# Altium project Board2.PrjPcb
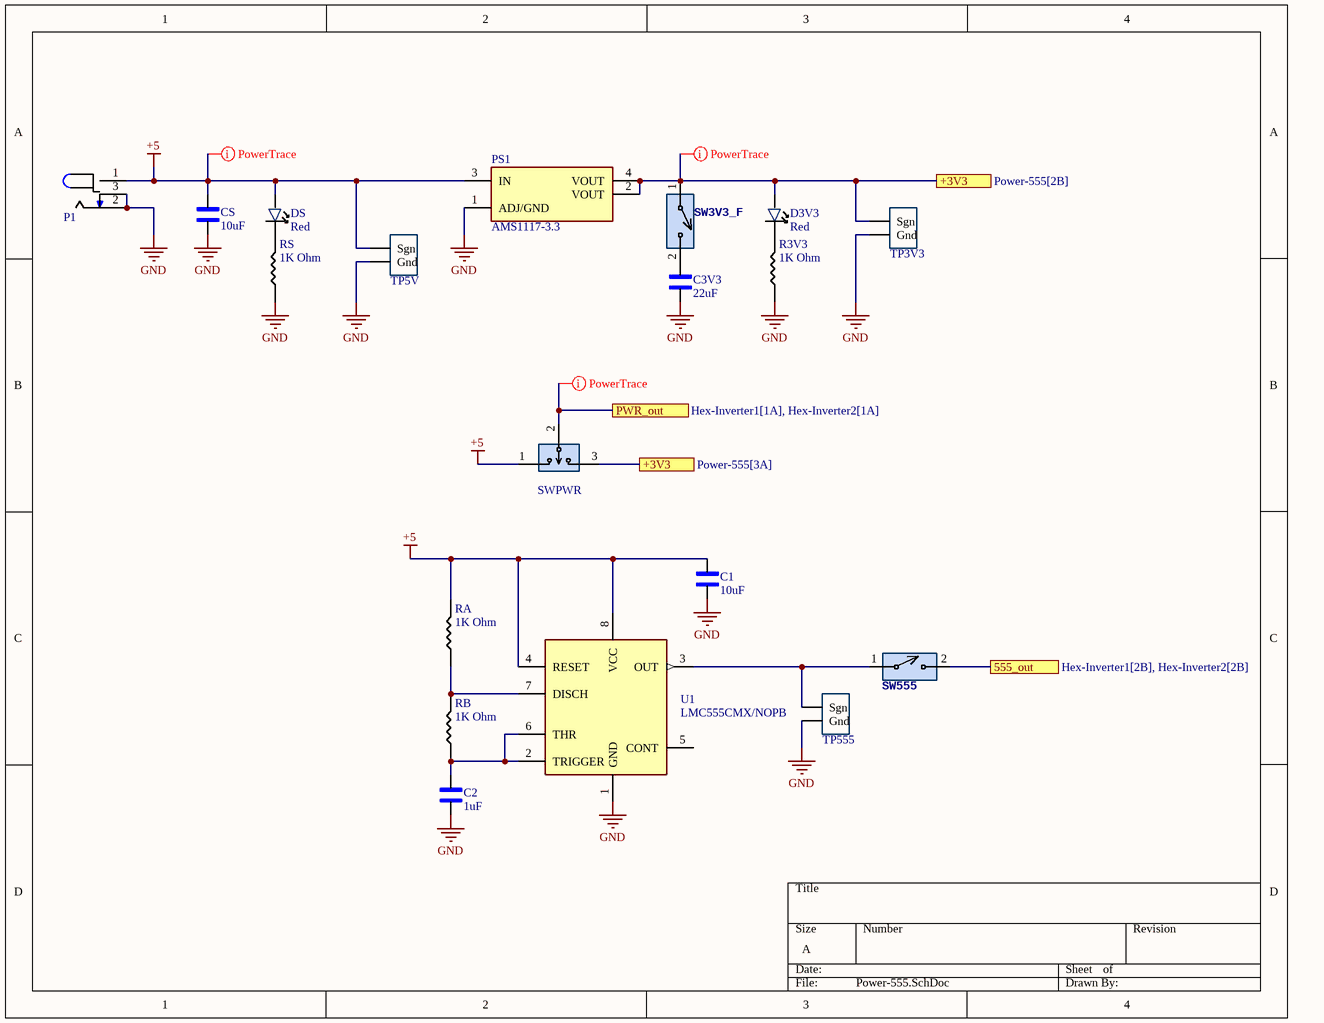
[diagram p0: Power-555.SchDoc]
3 sheets, 47 parts. Net scope: flat (ports and power ports of the same name join across sheets).
Board file: PCB1.PcbDoc
Sheets:
  Power-555.SchDoc
  Hex-Inverter1.SchDoc
  Hex-Inverter2.SchDoc

## Sheet Power-555.SchDoc
size A; SheetNumber: 1; SheetTotal: 3

### Parts
C1  10uF  [1206_Passive_Capacitor]
C2  1uF  [1206_Passive_Capacitor]
C3V3  22uF  [1206_Passive_Capacitor]
CS  10uF  [1206_Passive_Capacitor]
D3V3  Red  [LED_1206]
DS  Red  [LED_1206]
P1  Power Jack  [Power_Jack]  (value not drawn)
PS1  AMS1117-3.3  [LDO]
R3V3  value 1K Ohm  [1206_Passive_Resitor]  (hidden comment: 1k)
RA  value 1K Ohm  [1206_Passive_Resitor]  (hidden comment: 1k)
RB  value 1K Ohm  [1206_Passive_Resitor]  (hidden comment: 1k)
RS  value 1K Ohm  [1206_Passive_Resitor]  (hidden comment: 1k)
SW3V3_F  SW_2Pin_100mil_Switch  [2Pin-Header-Conn]  (value not drawn)
SW555  SW_2Pin_100mil_Switch  [2Pin-Header-Conn]  (value not drawn)
SWPWR  PREC003SAAN-RC  [3_PIN_100mil]  (value not drawn)
TP3V3  10x Probe TP  [TP10x_Probe]  (value not drawn)
TP5V  10x Probe TP  [TP10x_Probe]  (value not drawn)
TP555  10x Probe TP  [TP10x_Probe]  (value not drawn)
U1  LMC555CMX/NOPB  [TS555IDTTR]

### Ports
555_out (see Hex-Inverter1[2B], Hex-Inverter2[2B]), +3V3 (see Power-555[2B]), +3V3 (see Power-555[3A]), PWR_out (see Hex-Inverter1[1A], Hex-Inverter2[1A])

### Nets
+5: C1.2 CS.2 DS.1 P1.1 PS1.3(IN) RA.2 SWPWR.1 TP5V.1(Sgn) U1.4(RESET) U1.8(VCC)
GND: C1.1 C2.1 C3V3.1 CS.1 P1.2 P1.3 PS1.1(ADJ/GND) R3V3.1 RS.1 TP3V3.2(Gnd) TP5V.2(Gnd) TP555.2(Gnd) U1.1(GND)
NetC2_2: C2.2 RB.1 U1.2(TRIGGER) U1.6(THR)
NetC3V3_2: C3V3.2 SW3V3_F.2
NetD3V3_1: D3V3.1 PS1.2(VOUT) PS1.4(VOUT) SW3V3_F.1 SWPWR.3 TP3V3.1(Sgn) ; port +3V3
NetD3V3_2: D3V3.2 R3V3.2
NetDS_2: DS.2 RS.2
NetRA_1: RA.1 RB.2 U1.7(DISCH)
NetRBD_1: SW555.2 ; port 555_out
NetSW555_1: SW555.1 TP555.1(Sgn) U1.3(OUT)
NetSWBD_1: SWPWR.2 ; port PWR_out

Not connected (* = marked no-connect by the designer): U1 5(CONT)

### Layout directives
rule Width Constraint [Pref Width = 20mil    Min Width = 10mil    Max Width = 50mil]: +5, NetD3V3_1, NetSWBD_1

### Library data of the parts
C1 = C_10uF_1206: 10uF ±10% 50V X5R 1206 Multilayer Ceramic Capacitors MLCC - SMD/SMT RoHS; MFR Part #: CL31A106KBHNNNE; Type: Basic; LCSC Part#: C13585; Datasheet: https://datasheet.lcsc.com/lcsc/1810221112_Samsung-Electro-Mechanics-CL31A106KBHNNNE_C13585.pdf; Value: 10uF
C2 = C_1uF_1206: MULTILAYER CERAMIC CAPACITORS MLCC - SMD/SMT 1UF 50V 1206 ROHS; MFR Part #: CL31B105KBHNNNE; Type: Basic; Digikey Link: https://www.digikey.com/product-detail/en/C1206C105M4RACTU/399-8150-1-ND/3471873/?itemSeq=304982366; LCSC Part#: C1848; Value: 1uF
C3V3 = C_22uF_1206: 22uF ±10% 25V X5R 1206 Multilayer Ceramic Capacitors MLCC - SMD/SMT RoHS; MFR Part #: CL31A226KAHNNNE; Type: basic; LCSC Part#: C12891; Datasheet: https://datasheet.lcsc.com/lcsc/1811031514_Samsung-Electro-Mechanics-CL31A226KAHNNNE_C12891.pdf; Value: 22uF
CS = C_10uF_1206: 10uF ±10% 50V X5R 1206 Multilayer Ceramic Capacitors MLCC - SMD/SMT RoHS; MFR Part #: CL31A106KBHNNNE; LCSC Part#: C13585; Datasheet: https://datasheet.lcsc.com/lcsc/1810221112_Samsung-Electro-Mechanics-CL31A106KBHNNNE_C13585.pdf; Type: Basic; Value: 10uF
D3V3 = LED_RED_1206: Red 621~631nm 1206 Light Emitting Diodes (LED) RoHS; MFR Part #: 15-21/R6C-FQ1R1B/2T; Type: Extended; LCSC Part#: C93133; Datasheet: https://datasheet.lcsc.com/szlcsc/1811151241_Everlight-Elec-15-21-R6C-FQ1R1B-2T_C93133.pdf; Value: Red
DS = LED_RED_1206: Red 621~631nm 1206 Light Emitting Diodes (LED) RoHS; MFR Part #: 15-21/R6C-FQ1R1B/2T; LCSC Part#: C93133; Type: Extended; Datasheet: https://datasheet.lcsc.com/szlcsc/1811151241_Everlight-Elec-15-21-R6C-FQ1R1B-2T_C93133.pdf; Value: Red
P1 = P_Power Jack: Power Barrel Connector Jack 2.10mm ID (0.083"), 5.50mm OD (0.217") Through Hole, Right Angle; MFR Part #: PJ-102A; Value: CONN PWR JACK 2X5.5MM SOLDER; Digikey Link: https://www.digikey.com/product-detail/en/PJ-102A/CP-102A-ND/275425/?itemSeq=304982367; LCSC Part#: C136744; Type: Extended
PS1 = PS_AMS_LDO_3v3: LOW DROPOUT REGULATORS(LDO) POSITIVE FIXED 1.3V @ 800MA 15V 3.3V 1A SOT-223 ROHS; Value: IC REG LINEAR 3.3V 800MA SOT223; MFR Part #: AMS1117-3.3; LCSC Part#: C6186; Type: Basic
R3V3 RA RB RS = R_1K_1206: CHIP RESISTOR - SURFACE MOUNT 1KOHMS ±1% 1/4W 1206 ROHS; MFR Part #: RNCP1206FTD1K00CT; Digikey Link: https://www.digikey.com/product-detail/en/RNCP1206FTD1K00/RNCP1206FTD1K00CT-ND/2240675/?itemSeq=304982373; LCSC Part#: C4410; Type: Basic
SW3V3_F SW555 = SW_2Pin_100mil_Switch: 2Pin Header; LCSC Part#: C124375; Type: Extended
SWPWR = SW_3Pin_100mil_Switch: Connector Header Through Hole 3 position 0.100" (2.54mm); Value: CONN HEADER VERT 3POS 2.54MM; Digikey Link: https://www.digikey.com/product-detail/en/PREC003SAAN-RC/S1012EC-03-ND/2774851/?itemSeq=304982371; MFR Part #: PREC003SAAN-RC; Type: Extended; LCSC Part#: C49257
TP3V3 TP5V TP555 = TP_10x_Probe: Test Point 300 mil centers
U1 = U_555_Fast: 555 Type, Timer/Oscillator _Single_ IC 3MHz 8-SO; Package: SOIC-8; MFR Part #: LMC555CMX/NOPB; DigiKey link: https://www.digikey.com/product-detail/en/texas-instruments/LMC555CMX-NOPB/LMC555CMX-NOPBCT-ND/1010550; LCSC Part#: C90760; Type: Extended

## Sheet Hex-Inverter1.SchDoc
size A; SheetNumber: 2; SheetTotal: 3
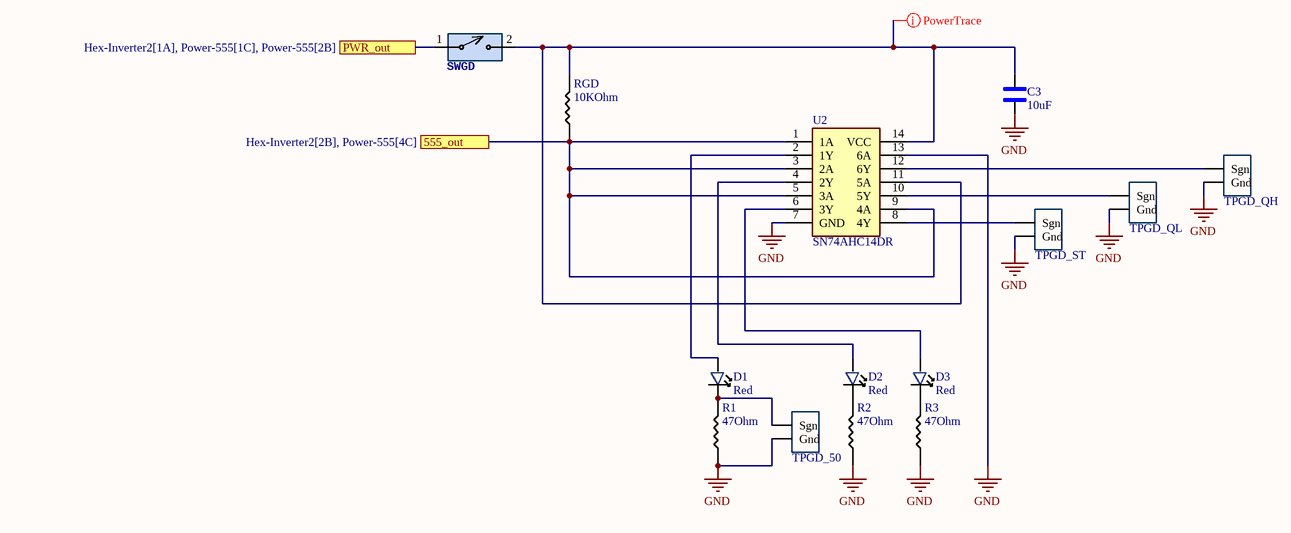
[diagram p1: Hex-Inverter1.SchDoc]

### Parts
C3  10uF  [1206_Passive_Capacitor]
D1  Red  [LED_1206]
D2  Red  [LED_1206]
D3  Red  [LED_1206]
R1  value 47Ohm  [1206_Passive_Resitor]  (hidden comment: 47 Ohms)
R2  value 47Ohm  [1206_Passive_Resitor]  (hidden comment: 47 Ohms)
R3  value 47Ohm  [1206_Passive_Resitor]  (hidden comment: 47 Ohms)
RGD  value 10KOhm  [1206_Passive_Resitor]  (hidden comment: 10k)
SWGD  SW_2Pin_100mil_Switch  [2Pin-Header-Conn]  (value not drawn)
TPGD_50  10x Probe TP  [TP10x_Probe]  (value not drawn)
TPGD_QH  10x Probe TP  [TP10x_Probe]  (value not drawn)
TPGD_QL  10x Probe TP  [TP10x_Probe]  (value not drawn)
TPGD_ST  10x Probe TP  [TP10x_Probe]  (value not drawn)
U2  SN74AHC14DR  [HEX_74AC14]

### Ports
555_out (see Hex-Inverter2[2B], Power-555[4C]), PWR_out (see Hex-Inverter2[1A], Power-555[1C], Power-555[2B])

### Nets
GND: C3.1 R1.1 R2.1 R3.1 TPGD_50.2(Gnd) TPGD_QH.2(Gnd) TPGD_QL.2(Gnd) TPGD_ST.2(Gnd) U2.7(GND) U2.13(6A)
NetC3_2: C3.2 RGD.2 SWGD.2 U2.11(5A) U2.14(VCC)
NetD1_1: D1.1 U2.2(1Y)
NetD1_2: D1.2 R1.2 TPGD_50.1(Sgn)
NetD2_1: D2.1 U2.4(2Y)
NetD2_2: D2.2 R2.2
NetD3_1: D3.1 U2.6(3Y)
NetD3_2: D3.2 R3.2
NetRBD_1: RGD.1 U2.1(1A) U2.3(2A) U2.5(3A) U2.9(4A) ; port 555_out
NetSWBD_1: SWGD.1 ; port PWR_out
NetTPGD_QH_1: TPGD_QH.1(Sgn) U2.12(6Y)
NetTPGD_QL_1: TPGD_QL.1(Sgn) U2.10(5Y)
NetTPGD_ST_1: TPGD_ST.1(Sgn) U2.8(4Y)

### Layout directives
rule Width Constraint [Pref Width = 20mil    Min Width = 10mil    Max Width = 50mil]: NetC3_2

### Library data of the parts
C3 = C_10uF_1206: as C1 on sheet Power-555; LCSC Part#: C13585; Datasheet: https://datasheet.lcsc.com/lcsc/1810221112_Samsung-Electro-Mechanics-CL31A106KBHNNNE_C13585.pdf; Value: 10uF
D1-D3 = LED_RED_1206: as D3V3 on sheet Power-555; LCSC Part#: C93133; Datasheet: https://datasheet.lcsc.com/szlcsc/1811151241_Everlight-Elec-15-21-R6C-FQ1R1B-2T_C93133.pdf; Value: Red
R1-R3 = R_47Ohm_1206: 47Ω ±5% 0.25W ±200ppm/℃ 1206 Chip Resistor - Surface Mount RoHS; MFR Part #: 1206W4J0470T5E; LCSC Part#: C25384; Type: Extended; Datasheet: https://datasheet.lcsc.com/lcsc/1811101020_UNI-ROYAL-Uniroyal-Elec-1206W4J0470T5E_C25384.pdf
RGD = R_10KOhm_1206: 10 kOhms ±5% 0.25W, 1/4W Chip Resistor 1206 (3216 Metric) Automotive AEC-Q200 Thick Film; MFR Part #: RMCF1206FT10K0; Digikey Link: https://www.digikey.com/en/products/detail/stackpole-electronics-inc/RMCF1206FT10K0/1759669; LCSC Part#: C17902; Type: Basic
SWGD = SW_2Pin_100mil_Switch: 2Pin Header; LCSC Part#: C124375; Type: Extended
TPGD_50 TPGD_QH TPGD_QL TPGD_ST = TP_10x_Probe: Test Point 300 mil centers
U2 = U_74AHC14: Inverter IC 6 Channel Schmitt Trigger 14-SOIC; Datasheet: https://datasheet.lcsc.com/szlcsc/ON-Semicon-ON-74AC14SCX_C5482.pdf; MFR Part #: SN74AHC14DR; LCSC Part#: C6942; Type: Extended

## Sheet Hex-Inverter2.SchDoc
size A; SheetNumber: 3; SheetTotal: 3
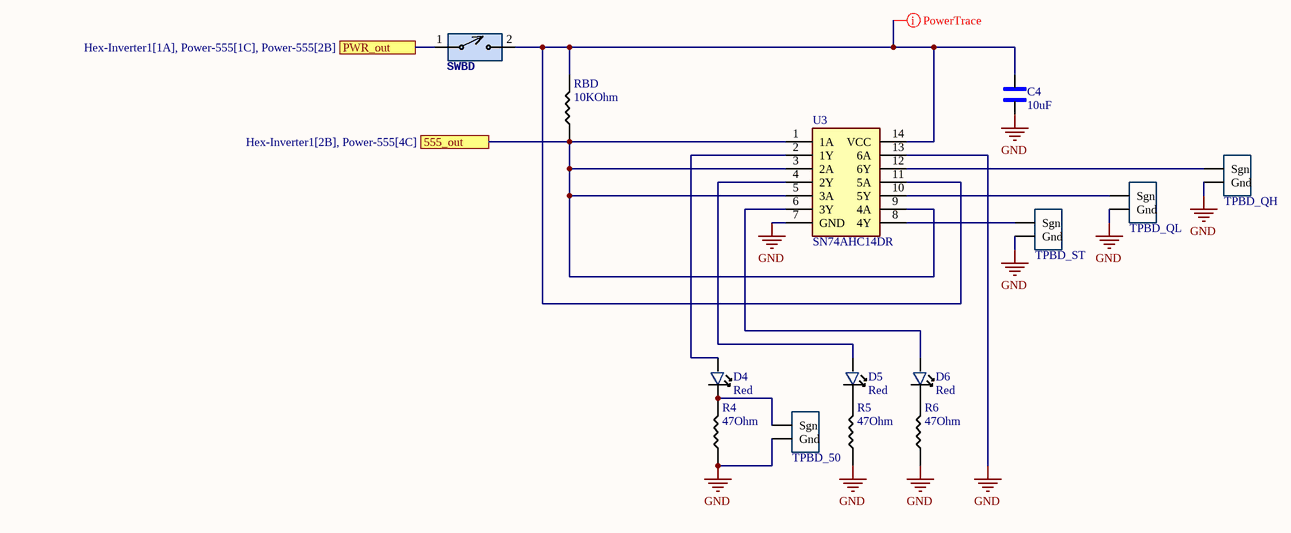
[diagram p2: Hex-Inverter2.SchDoc]

### Parts
C4  10uF  [1206_Passive_Capacitor]
D4  Red  [LED_1206]
D5  Red  [LED_1206]
D6  Red  [LED_1206]
R4  value 47Ohm  [1206_Passive_Resitor]  (hidden comment: 47 Ohms)
R5  value 47Ohm  [1206_Passive_Resitor]  (hidden comment: 47 Ohms)
R6  value 47Ohm  [1206_Passive_Resitor]  (hidden comment: 47 Ohms)
RBD  value 10KOhm  [1206_Passive_Resitor]  (hidden comment: 10k)
SWBD  SW_2Pin_100mil_Switch  [2Pin-Header-Conn]  (value not drawn)
TPBD_50  10x Probe TP  [TP10x_Probe]  (value not drawn)
TPBD_QH  10x Probe TP  [TP10x_Probe]  (value not drawn)
TPBD_QL  10x Probe TP  [TP10x_Probe]  (value not drawn)
TPBD_ST  10x Probe TP  [TP10x_Probe]  (value not drawn)
U3  SN74AHC14DR  [HEX_74AC14]

### Ports
555_out (see Hex-Inverter1[2B], Power-555[4C]), PWR_out (see Hex-Inverter1[1A], Power-555[1C], Power-555[2B])

### Nets
GND: C4.1 R4.1 R5.1 R6.1 TPBD_50.2(Gnd) TPBD_QH.2(Gnd) TPBD_QL.2(Gnd) TPBD_ST.2(Gnd) U3.7(GND) U3.13(6A)
NetC4_2: C4.2 RBD.2 SWBD.2 U3.11(5A) U3.14(VCC)
NetD4_1: D4.1 U3.2(1Y)
NetD4_2: D4.2 R4.2 TPBD_50.1(Sgn)
NetD5_1: D5.1 U3.4(2Y)
NetD5_2: D5.2 R5.2
NetD6_1: D6.1 U3.6(3Y)
NetD6_2: D6.2 R6.2
NetRBD_1: RBD.1 U3.1(1A) U3.3(2A) U3.5(3A) U3.9(4A) ; port 555_out
NetSWBD_1: SWBD.1 ; port PWR_out
NetTPBD_QH_1: TPBD_QH.1(Sgn) U3.12(6Y)
NetTPBD_QL_1: TPBD_QL.1(Sgn) U3.10(5Y)
NetTPBD_ST_1: TPBD_ST.1(Sgn) U3.8(4Y)

### Layout directives
rule Width Constraint [Pref Width = 20mil    Min Width = 10mil    Max Width = 50mil]: NetC4_2

### Library data of the parts
C4 = C_10uF_1206: as C1 on sheet Power-555; LCSC Part#: C13585; Datasheet: https://datasheet.lcsc.com/lcsc/1810221112_Samsung-Electro-Mechanics-CL31A106KBHNNNE_C13585.pdf; Value: 10uF
D4-D6 = LED_RED_1206: as D3V3 on sheet Power-555; LCSC Part#: C93133; Datasheet: https://datasheet.lcsc.com/szlcsc/1811151241_Everlight-Elec-15-21-R6C-FQ1R1B-2T_C93133.pdf; Value: Red
R4-R6 = R_47Ohm_1206: as R1 on sheet Hex-Inverter1; LCSC Part#: C25384; Type: Extended; Datasheet: https://datasheet.lcsc.com/lcsc/1811101020_UNI-ROYAL-Uniroyal-Elec-1206W4J0470T5E_C25384.pdf
RBD = R_10KOhm_1206: as RGD on sheet Hex-Inverter1; Digikey Link: https://www.digikey.com/en/products/detail/stackpole-electronics-inc/RMCF1206FT10K0/1759669; LCSC Part#: C17902; Type: Basic
SWBD = SW_2Pin_100mil_Switch: 2Pin Header; LCSC Part#: C124375; Type: Extended
TPBD_50 TPBD_QH TPBD_QL TPBD_ST = TP_10x_Probe: Test Point 300 mil centers
U3 = U_74AHC14: as U2 on sheet Hex-Inverter1; Datasheet: https://datasheet.lcsc.com/szlcsc/ON-Semicon-ON-74AC14SCX_C5482.pdf; MFR Part #: SN74AHC14DR; LCSC Part#: C6942; Type: Extended

## Nets that join several sheets
GND: Power-555 (13 pins), Hex-Inverter1 (10 pins), Hex-Inverter2 (10 pins)
NetRBD_1: Power-555 (SW555.2), Hex-Inverter1 (5 pins), Hex-Inverter2 (5 pins)
NetSWBD_1: Power-555 (SWPWR.2), Hex-Inverter1 (SWGD.1), Hex-Inverter2 (SWBD.1)